# EAGLE design 24vacToIrRelayBoard-v1.2 (EAGLE 6.6.0)
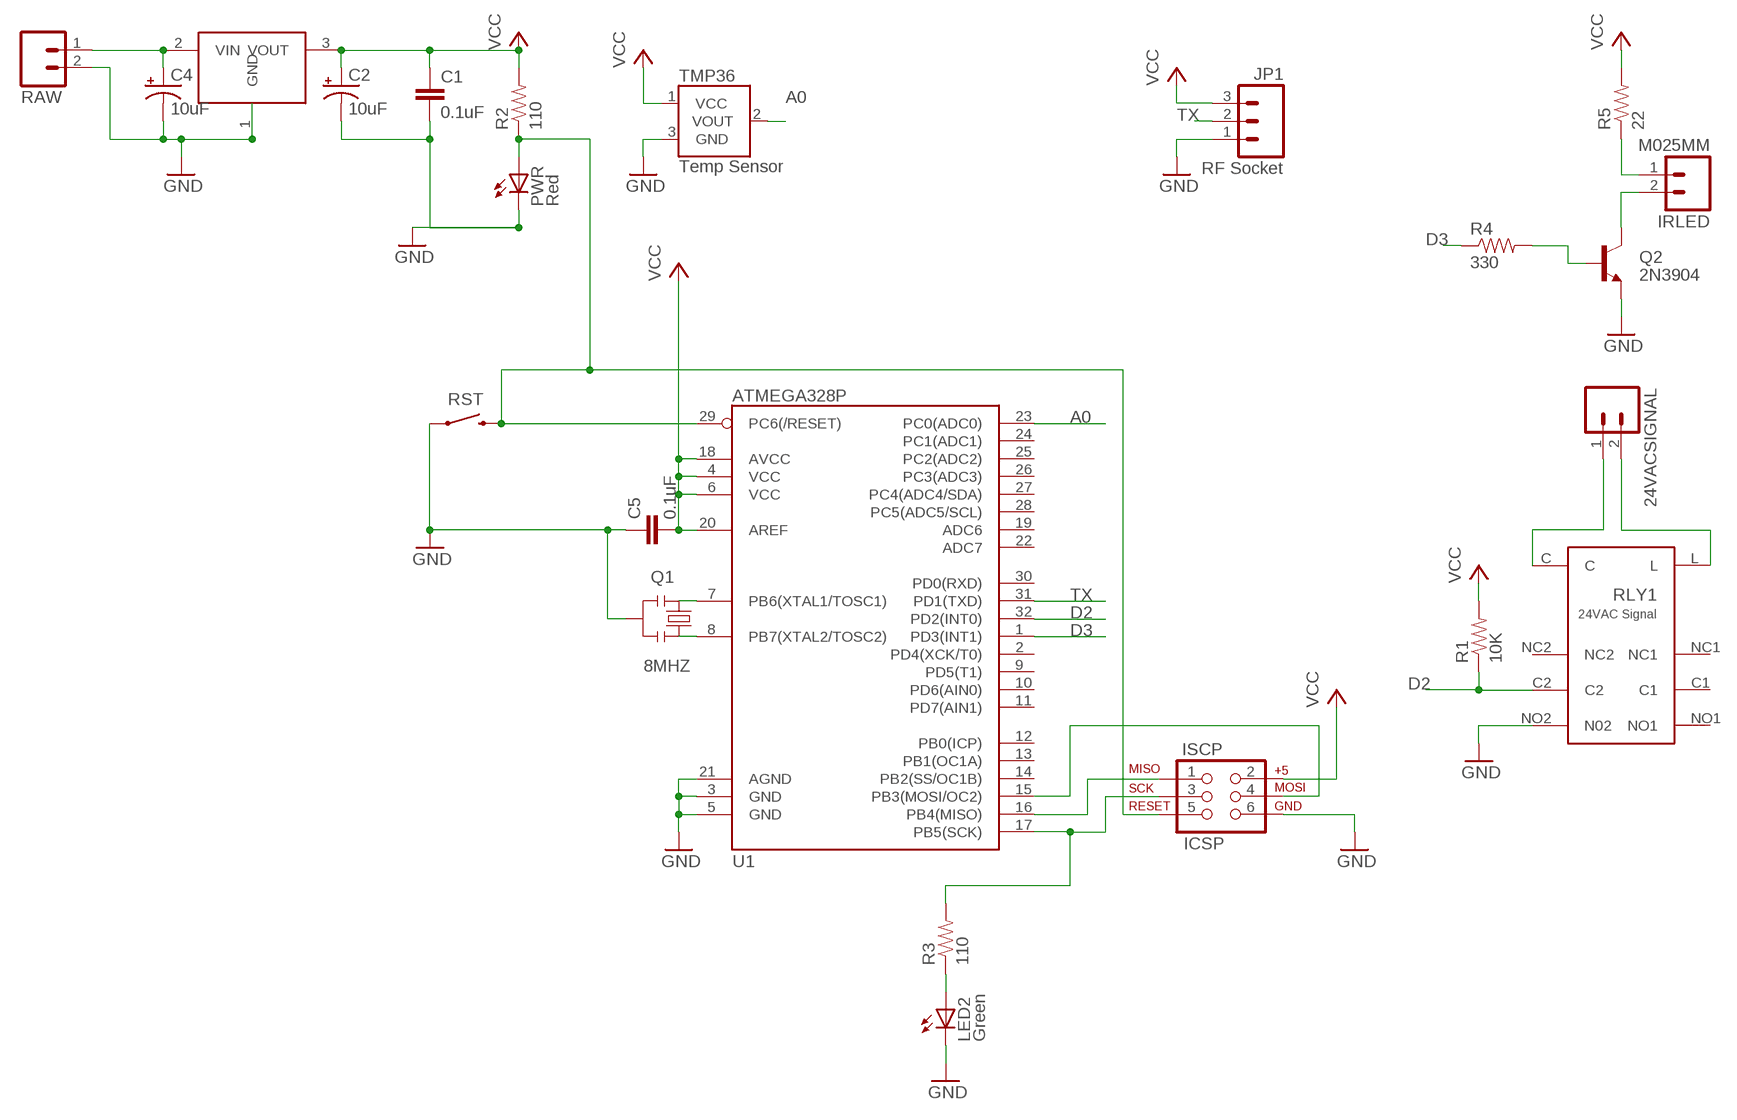
[diagram p0: schematic, sheet 1]

## Parts
24VACSIGNAL  M025MM  [SCREWTERMINAL-5MM-2]
C1  0.1uF  0.1UF-25V-5%(0603)  [0603-CAP]
C2  10uF  10UF-16V-10%(TANT)  [EIA3216]
C4  10uF  10UF-16V-10%(TANT)  [EIA3216]
C5  0.1uF  0.1UF-25V-5%(0603)  [0603-CAP]
IRLED  M025MM  [SCREWTERMINAL-5MM-2]
ISCP  ICSP  AVR_SPI_PRG_6NS  [2X3-NS]
JP1  RF Socket  M03PTH  [1X03]
LED2  Green  LED0603  [LED-0603]
PWR  Red  LED0603  [LED-0603]
Q1  8MHZ  RESONATOR8MHZ  [RESONATOR-SMD]
Q2  2N3904  TRANSISTOR_NPNSOT23-3  [SOT23-3]
R1  10K  10KOHM1/10W1%(0603)0603  [0603-RES]
R2  110  10KOHM1/10W1%(0603)0603  [0603-RES]
R3  110  10KOHM1/10W1%(0603)0603  [0603-RES]
R4  330  10KOHM1/10W1%(0603)0603  [0603-RES]
R5  22  10KOHM1/10W1%(0603)0603  [0603-RES]
RAW  M025MM  [SCREWTERMINAL-5MM-2]
RLY1  24VAC Signal  976XAX97H-24AA  [976RELAY]
RST  SWITCH-MOMENTARY-2PTH  [TACTILE-PTH]
TMP36  Temp Sensor  TMP36GT9  [TO-92]
U1  ATMEGA328P  ATMEGA328_SMT  [TQFP32-08]
U$1  MCP1702  [TO92]

## Nets
A0: TMP36.2(VOUT) U1.23(PC0(ADC0))
D2: R1.1 RLY1.C2 U1.32(PD2(INT0))
D3: R4.1 U1.1(PD3(INT1))
GND: C1.2 C2.C(-) C4.C(-) C5.1 ISCP.6 JP1.1 LED2.C PWR.C Q1.2 Q2.2(E) RAW.2 RLY1.NO2(N02) RST.1 TMP36.3(GND) U1.3(GND) U1.5(GND) U1.21(AGND) U$1.1(GND)
MISO: ISCP.1 U1.16(PB4(MISO))
MOSI: ISCP.4 U1.15(PB3(MOSI/OC2))
N$1: C4.A(+) RAW.1 U$1.2(VIN)
N$2: Q1.1 U1.7(PB6(XTAL1/TOSC1))
N$3: Q1.3 U1.8(PB7(XTAL2/TOSC2))
N$4: LED2.A R3.1
N$6: IRLED.1 R5.1
N$7: IRLED.2 Q2.3(C)
N$8: Q2.1(B) R4.2
N$9: 24VACSIGNAL.2 RLY1.L
N$10: 24VACSIGNAL.1 RLY1.C
RST: ISCP.5 PWR.A R2.1 RST.3 U1.29(PC6(/RESET))
SCK: ISCP.3 R3.2 U1.17(PB5(SCK))
TX: JP1.2 U1.31(PD1(TXD))
VCC: C1.1 C2.A(+) C5.2 ISCP.2 JP1.3 R1.2 R2.2 R5.2 TMP36.1(VCC) U1.4(VCC) U1.6(VCC) U1.18(AVCC) U1.20(AREF) U$1.3(VOUT)
Unconnected: RLY1.C1 RLY1.NC1 RLY1.NC2 RLY1.NO1 U1.2(PD4(XCK/T0)) U1.9(PD5(T1)) U1.10(PD6(AIN0)) U1.11(PD7(AIN1)) U1.12(PB0(ICP)) U1.13(PB1(OC1A)) U1.14(PB2(SS/OC1B)) U1.19(ADC6) U1.22(ADC7) U1.24(PC1(ADC1)) U1.25(PC2(ADC2)) U1.26(PC3(ADC3)) U1.27(PC4(ADC4/SDA)) U1.28(PC5(ADC5/SCL)) U1.30(PD0(RXD))

## Library data of the parts
24VACSIGNAL IRLED RAW = SparkFun-Connectors:M02: Standard 2-pin 0.1" header. Use with - straight break away headers ( PRT-00116) - right angle break away headers (PRT-00553) - swiss pins (PRT-00743) - machine pins (PRT-00117) - female headers (PRT-00115) Molex polarized connector foot print use with: PRT-08233 with associated crimp pins and housings. 2.54_SCREWTERM for use with PRT-10571. 3.5mm Screw Terminal footprints for PRT-08084 5mm Screw Terminal footprints for use with PRT-08433
C1 C5 = SparkFun-Capacitors:0.1UF-25V-5%(0603): CAP-08604; PROD_ID: CAP-08604
C2 C4 = SparkFun-Capacitors:10UF-16V-10%(TANT): CAP-00811 1206/EIA-3216 Tantalum capacitor; PROD_ID: CAP-00811
ISCP = SparkFun-Connectors:AVR_SPI_PRG_6: AVR ISP 6 Pin This is the reduced ISP connector for AVR programming. Common on Arduino. This footprint will take up less PCB space and can be used with a 10-pin to 6-pin adapter such as SKU: BOB-08508
JP1 = SparkFun-Connectors:M03: Header 3 Standard 3-pin 0.1" header. Use with straight break away headers (SKU : PRT-00116), right angle break away headers (PRT-00553), swiss pins (PRT-00743), machine pins (PRT-00117), and female headers (PRT-00115). Molex polarized connector foot print use with SKU : PRT-08232 with associated crimp pins and housings.
LED2 PWR = SparkFun-LED:LED: LEDs Standard schematic elements and footprints for 5mm, 3mm, 1206, and 0603 sized LEDs. 5mm - Spark Fun Electronics SKU : COM-00529 (and others)
Q1 = SparkFun-FreqCtrl:RESONATOR: Resonator Small SMD resonator. Used, eg, on the Arduino Pro/ Pro Mini boards. 8MHz- XTAL-08895 16MHz- XTAL-08900; PROD_ID: XTAL-08895
Q2 = SparkFun-DiscreteSemi:TRANSISTOR_NPN: Generic NPN BJT MMBT2222A - TRANS-08049 (SOT-23, 1A 40V) MPSA42 - TRANS-09116 (SOT-23, 500mA 300V) MMBT5088LT1G - TRANS-11160 (SOT-23, 50 mA 30V)
R1 = SparkFun-Resistors:10KOHM1/10W1%(0603): RES-00824; PROD_ID: RES-00824
R2-R5 = SparkFun-Resistors:10KOHM1/10W1%(0603): RES-00824; PROD_ID: RES-00824; VALUE: 10K
RLY1 = magnecraft:976XAX97H-24A
RST = SparkFun-Electromechanical:SWITCH-MOMENTARY-2: Various NO switches- pushbuttons, reed, etc
TMP36 = SparkFun-Sensors:TMP36: Precision degC temp sensor, analog out
U1 = SparkFun-DigitalIC:ATMEGA328_SMT: 32-Pin Atmega328 part Commonly used on Arduino compatible boards Available in QFP and QFN packages TQFP is IC-09069 QFN is non-stock; PROD_ID: IC-09069
U$1 = microchip:MCP1702

## Board
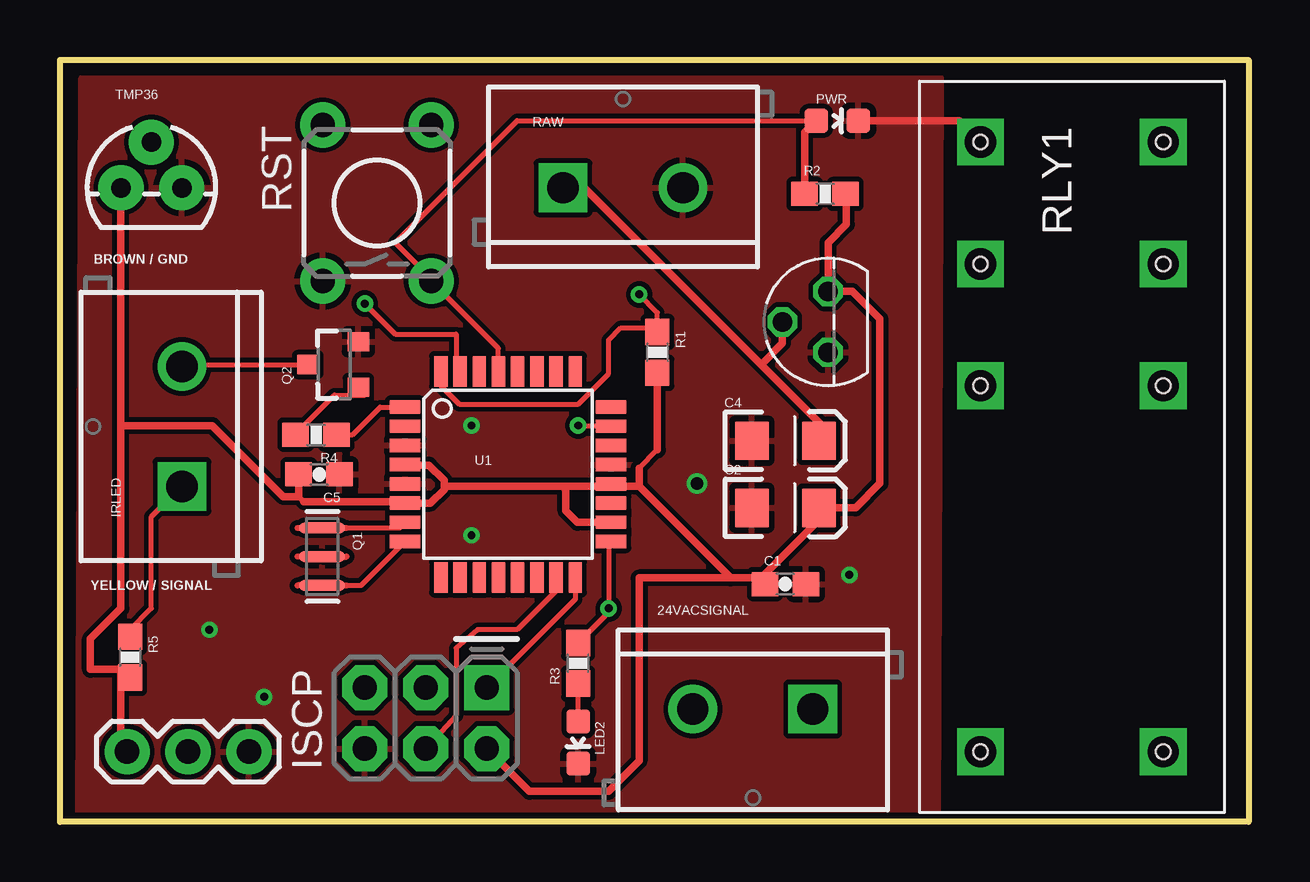
[diagram p1: board, top side]
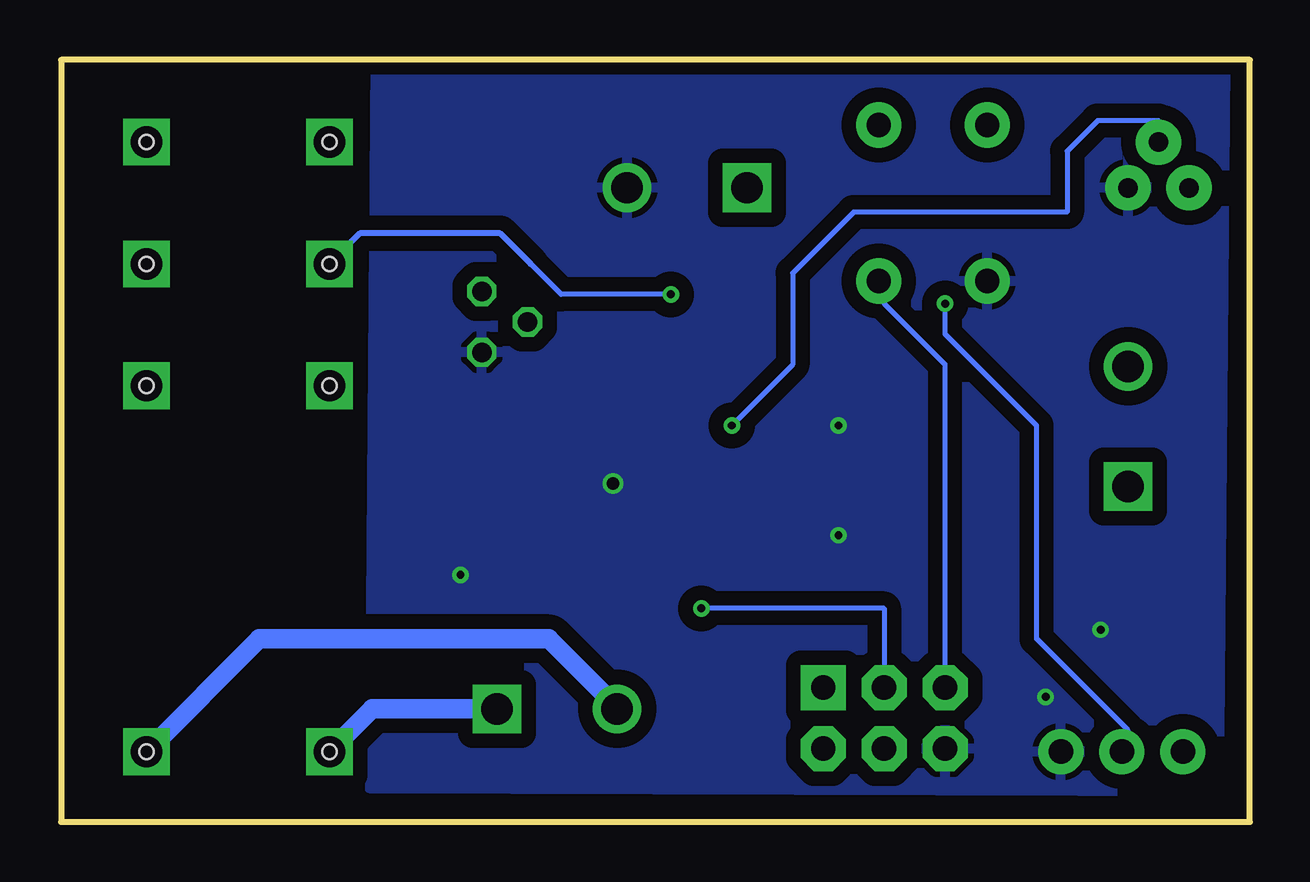
[diagram p2: board, bottom side, seen from below]

Size 49.58 x 31.74 mm. Coordinates in mm from the lower left corner, seen from the top.
Outline: 0,0 49.58,0 49.58,31.74 0,31.74 0,0
Copper layers (1*16): Top 0.0356mm / dielectric 1.5011mm / Bottom 0.0356mm
Design rules "OshPark *": minimum track width 8mil, minimum drill 13mil, track to track 8mil, track to pad 8mil, pad to pad 8mil, via to via 8mil, smd to smd 8mil, copper to edge 15mil, drill to drill 6mil, minimum pad ring 7mil, minimum via ring 7mil, stop-mask expansion 3mil, vias tented up to drill 0mil, thermal gap 10mil
Milling: 4 lines

### Footprints (pad centres in the part's own frame; a part is rotated, then mirrored left to right if it is on the bottom)
SCREWTERMINAL-5MM-2 = drill 1.3 pad 2.032 square: 1 0,0 | drill 1.3 pad 2.032: 2 5,0
0603-CAP = smd 1.1 x 1: 1 -0.85,0; 2 0.85,0
EIA3216 = smd 1.4 x 1.6: A 1.4,0; C -1.4,0
2X3-NS = drill 1.016 pad 1.88 square: 1 -2.54,-1.27 | drill 1.016 pad 1.88 octagon: 2 -2.54,1.27; 3 0,-1.27; 4 0,1.27; 5 2.54,-1.27; 6 2.54,1.27
1X03 = drill 1.016 pad 1.88: 1 0,0; 2 2.54,0; 3 5.08,0
LED-0603 = smd 1 x 1: A 0,-0.877; C 0,0.877
RESONATOR-SMD = smd 0.45 x 1.905: 1 -1.2,0; 2 0,0; 3 1.2,0
SOT23-3 = smd 0.8 x 0.9: 1 -0.95,-1; 2 0.95,-1; 3 0,1.1
0603-RES = smd 1.1 x 1: 1 -0.85,0; 2 0.85,0
976RELAY = drill 1.3 square: C 20.32,-2.54; C1 0,5.08; C2 0,-2.54; L 20.32,5.08; NC1 5.08,5.08; NC2 5.08,-2.54; NO1 -5.08,5.08; NO2 -5.08,-2.54 | hole 0.6: -5.08,5.08; -5.08,-2.54; 0,5.08; 5.08,5.08; 5.08,-2.54; 0,-2.54; 20.32,5.08; 20.32,-2.54
TACTILE-PTH = drill 1.016 pad 1.88: 1 -3.251,2.261; 2 3.251,2.261; 3 -3.251,-2.261; 4 3.251,-2.261
TO-92 = drill 0.813 pad 1.88: 1 -1.27,0; 2 0,1.905; 3 1.27,0
TQFP32-08 = smd 1.27 x 0.559: 1 -4.293,2.8; 2 -4.293,2; 3 -4.293,1.2; 4 -4.293,0.4; 5 -4.293,-0.4; 6 -4.293,-1.2; 7 -4.293,-2; 8 -4.293,-2.8; 17 4.293,-2.8; 18 4.293,-2; 19 4.293,-1.2; 20 4.293,-0.4; 21 4.293,0.4; 22 4.293,1.2; 23 4.293,2; 24 4.293,2.8 | smd 0.559 x 1.27: 9 -2.8,-4.293; 10 -2,-4.293; 11 -1.2,-4.293; 12 -0.4,-4.293; 13 0.4,-4.293; 14 1.2,-4.293; 15 2,-4.293; 16 2.8,-4.293; 25 2.8,4.293; 26 2,4.293; 27 1.2,4.293; 28 0.4,4.293; 29 -0.4,4.293; 30 -1.2,4.293; 31 -2,4.293; 32 -2.8,4.293
TO92 = drill 0.813 octagon: 1 -1.27,0; 2 0,1.905; 3 1.27,0

### Placement (x,y rotation side)
24VACSIGNAL  31.37,4.7 180 top
C1  30.23,9.91 0 top
C2  30.23,13.08 0 top
C4  30.23,15.88 0 top
C5  10.79,14.48 180 top
IRLED  5.08,13.97 90 top
ISCP  15.24,4.32 180 top
JP1  7.87,2.92 180 top
LED2  21.59,3.3 180 top
PWR  32.38,29.21 270 top
Q1  10.92,11.05 270 top
Q2  11.43,19.05 90 top
R1  24.89,19.56 270 top
R2  31.88,26.16 0 top
R3  21.59,6.6 90 top
R4  10.67,16.13 180 top
R5  2.92,6.86 270 top
RAW  20.95,26.42 0 top
RLY1  40.89,23.24 270 top
RST  13.21,25.78 90 top
TMP36  3.81,26.42 0 top
U1  18.67,14.48 0 top
U$1  32,20.83 90 top

### Tracks (layer width: path | path; a pad name or v marks a point on that pad's centre or on a via)
A0  (via drill 0.33)
  Top 0.203: v21.59,16.51 22.86,16.51 U1.23
  Bottom 0.203: v21.59,16.51 19.05,19.05 19.05,22.86 16.51,25.4 7.62,25.4 7.62,27.94 6.35,29.21 3.81,29.21 TMP36.2
D2  (via drill 0.33)
  Top 0.203: U1.32 15.87,18.17 16.64,17.4 21.59,17.4 22.86,18.67 22.86,20.07 23.37,20.57 24.73,20.57 R1.1 24.89,21.21 v24.13,21.97
  Bottom 0.203: v24.13,21.97 28.7,21.97 29.97,23.24
  Bottom 0.254: 29.97,23.24 31.24,24.51 37.08,24.51 RLY1.C2
D3
  Top 0.203: R4.1 12.19,16.13 13.34,17.27 U1.1
GND  (via drill 0.33, 0.51)
  Top 0.305: PWR.C 37.47,29.21 RLY1.NO2
  other vias: 26.54,14.1 32.89,10.29 8.51,5.21 6.22,8 17.14,16.51 17.14,11.94
  pour Bottom (isolate 0.61): 1.02,31.62 36.45,31.75 36.7,1.4 1.27,1.27
  pour Top: 0.76,0 0.89,30.99 36.7,30.99 36.58,0
MISO
  Top 0.203: U1.16 21.47,9.28 ISCP.1
MOSI
  Top 0.203: U1.15 20.67,9.62 19.05,8 17.4,8 16.51,7.24 16.51,4.45 ISCP.4
N$1
  Top 0.203: 31.75,16.51 C4.A
  Top 0.305: 29.21,19.05 21.59,26.67 RAW.1 | 29.21,19.05 31.75,16.51 | U$1.2 30.1,19.94 29.21,19.05
N$2
  Top 0.203: 11.94,12.25 14.15,12.25 U1.7
N$3
  Top 0.203: 11.94,9.85 12.55,9.85 U1.8
N$4
  Top 0.203: 21.59,3.81 LED2.A R3.1
N$6
  Top 0.203: R5.1 2.92,8 3.81,8.89 3.81,12.7 IRLED.1
N$7
  Top 0.203: Q2.3 5.08,19.05 IRLED.2
N$8
  Top 0.203: Q2.1 12.7,17.78 11.43,17.78 10.16,16.51 R4.2
N$9
  Bottom 0.813: 24VACSIGNAL.2 26.37,4.78 29.21,7.62 41.27,7.62 RLY1.L
N$10
  Bottom 0.813: 24VACSIGNAL.1 36.58,4.7 RLY1.C
RST
  Top 0.203: 31.75,29.21 PWR.A 19.05,29.21 13.97,24.13 15.24,22.86 RST.3 18.27,19.73 U1.29
  Top 0.305: R2.1 31.03,28.73 PWR.A
  Bottom 0.203: RST.3 15.24,22.86 15.24,21.59 12.7,19.05 ISCP.5
SCK  (via drill 0.33)
  Top 0.203: U1.17 22.86,11.43 v22.86,8.89 22.86,8.72 R3.2
  Bottom 0.203: v22.86,8.89 15.24,8.89 ISCP.3
TX  (via drill 0.33)
  Top 0.203: v12.7,21.59 13.97,20.32 16.51,20.32 16.51,19.05 U1.31
  Bottom 0.203: v12.7,21.59 12.7,20.32 8.89,16.51 8.89,7.62 5.08,3.81 JP1.2
VCC
  Top 0.203: 2.54,26.67 TMP36.1 | 22.86,13.97 U1.20 | 29.21,10.16 C1.1 | 31.75,12.7 C2.A | 2.54,6.35 R5.2 | 24.13,14.73 24.89,15.49 | 9.95,13.55 10.16,13.34 | 14.32,13.34 U1.6
  Top 0.305: JP1.3 2.54,3.81 2.54,6.35 1.27,6.35 1.27,7.62 2.54,8.89 2.54,16.51 | 2.54,16.51 TMP36.1 | 31.75,12.7 29.21,10.16 27.94,10.16 | 24.13,13.97 22.86,13.97 20.95,13.97 | 27.94,10.16 24.13,13.97 | 27.94,10.16 24.13,10.16 24.13,2.54 22.86,1.27 19.56,1.27 ISCP.2 | 24.13,13.97 24.13,14.73 | 24.89,15.49 R1.2 | R2.2 32.77,26.12 32.77,24.89 32,24.13 U$1.3 33.02,22.1 34.16,20.95 34.16,14.1 33.15,13.08 C2.A | C5.2 9.95,13.55 9.31,13.55 6.35,16.51 2.54,16.51 | 10.16,13.34 14.32,13.34 | U1.6 15.44,13.28 16,13.84 16,13.97 | 16,13.97 16,14.22 15.37,14.86 14.39,14.86 U1.4 | 20.95,13.97 16,13.97 | U1.18 21.56,12.48 21.08,12.95 21.08,13.84 20.95,13.97

### Text on the board
tPlace: BROWN / GND | YELLOW / SIGNAL